# Altium schematic sheet 08.USB3.0-RGMII.SchDoc
size A3; CheckedBy: LJX; DocumentNumber: 8; Revision: V1.00; SheetNumber: 08; SheetTotal: 18; SheetName: USB3.0-RGMII; SheetDescribe: USB3.0-RGMII; Designer: JOW; DesignDate: 2025-05-20; CheckedData: 2025-05-21; Rule: PcbType=ProtelPcb
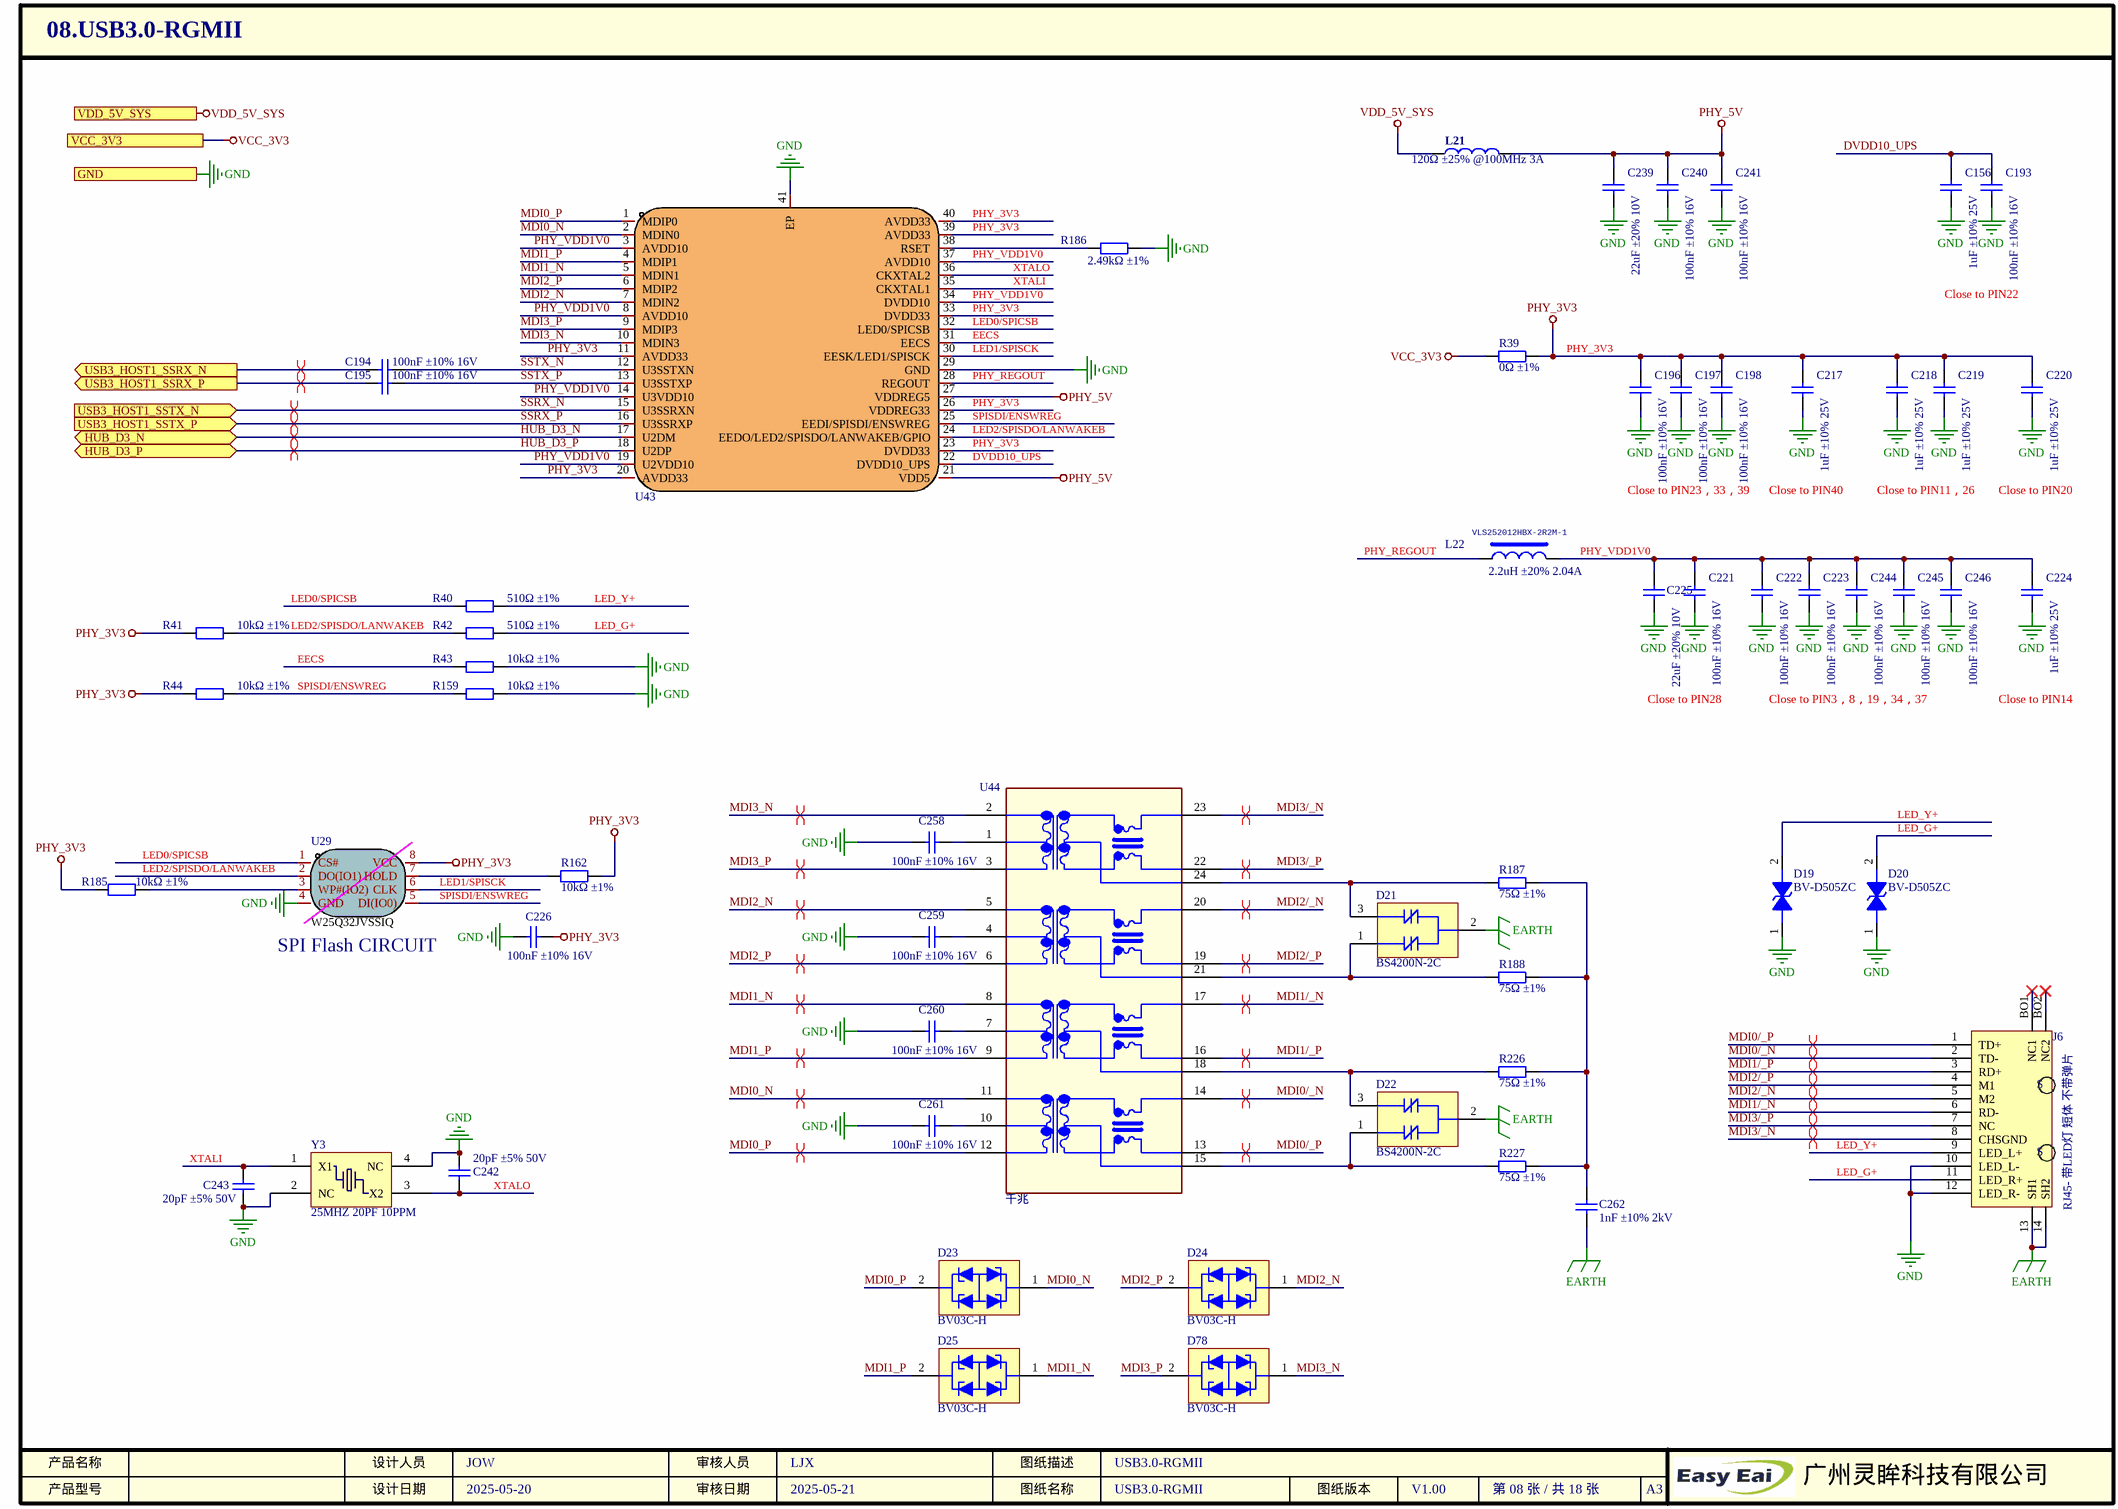
[diagram p0: 08.USB3.0-RGMII.SchDoc]

## Parts
C156  描述: 1uF ±10% 25V  [0402_C]  (hidden comment: CL05A105KA5NQNC)
C193  描述: 100nF ±10% 16V  [0402_C]  (hidden comment: CL05B104KO5NNNC)
C194  描述: 100nF ±10% 16V  [0402_C]  (hidden comment: CL05B104KO5NNNC)
C195  描述: 100nF ±10% 16V  [0402_C]  (hidden comment: CL05B104KO5NNNC)
C196  描述: 100nF ±10% 16V  [0402_C]  (hidden comment: CL05B104KO5NNNC)
C197  描述: 100nF ±10% 16V  [0402_C]  (hidden comment: CL05B104KO5NNNC)
C198  描述: 100nF ±10% 16V  [0402_C]  (hidden comment: CL05B104KO5NNNC)
C217  描述: 1uF ±10% 25V  [0402_C]  (hidden comment: CL05A105KA5NQNC)
C218  描述: 1uF ±10% 25V  [0402_C]  (hidden comment: CL05A105KA5NQNC)
C219  描述: 1uF ±10% 25V  [0402_C]  (hidden comment: CL05A105KA5NQNC)
C220  描述: 1uF ±10% 25V  [0402_C]  (hidden comment: CL05A105KA5NQNC)
C221  描述: 100nF ±10% 16V  [0402_C]  (hidden comment: CL05B104KO5NNNC)
C222  描述: 100nF ±10% 16V  [0402_C]  (hidden comment: CL05B104KO5NNNC)
C223  描述: 100nF ±10% 16V  [0402_C]  (hidden comment: CL05B104KO5NNNC)
C224  描述: 1uF ±10% 25V  [0402_C]  (hidden comment: CL05A105KA5NQNC)
C225  描述: 22uF ±20% 10V  [0603_C]  (hidden comment: CL10A226MP8NUNE)
C226  描述: 100nF ±10% 16V  [0402_C]  (hidden comment: CL05B104KO5NNNC)
C239  描述: 22uF ±20% 10V  [0603_C]  (hidden comment: CL10A226MP8NUNE)
C240  描述: 100nF ±10% 16V  [0402_C]  (hidden comment: CL05B104KO5NNNC)
C241  描述: 100nF ±10% 16V  [0402_C]  (hidden comment: CL05B104KO5NNNC)
C242  描述: 20pF ±5% 50V  [0402_C]  (hidden comment: 0402CG200J500NT)
C243  描述: 20pF ±5% 50V  [0402_C]  (hidden comment: 0402CG200J500NT)
C244  描述: 100nF ±10% 16V  [0402_C]  (hidden comment: CL05B104KO5NNNC)
C245  描述: 100nF ±10% 16V  [0402_C]  (hidden comment: CL05B104KO5NNNC)
C246  描述: 100nF ±10% 16V  [0402_C]  (hidden comment: CL05B104KO5NNNC)
C258  描述: 100nF ±10% 16V  [0402_C]  (hidden comment: CL05B104KO5NNNC)
C259  描述: 100nF ±10% 16V  [0402_C]  (hidden comment: CL05B104KO5NNNC)
C260  描述: 100nF ±10% 16V  [0402_C]  (hidden comment: CL05B104KO5NNNC)
C261  描述: 100nF ±10% 16V  [0402_C]  (hidden comment: CL05B104KO5NNNC)
C262  描述: 1nF ±10% 2kV  [1206_C]  (hidden comment: CC1206KKX7RDBB102)
D19  BV-D505ZC  [SOD-523]
D20  BV-D505ZC  [SOD-523]
D21  BS4200N-2C  [SMB-T_L5.4-W3.3-BI]
D22  BS4200N-2C  [SMB-T_L5.4-W3.3-BI]
D23  BV03C-H  [SOD-323]
D24  BV03C-H  [SOD-323]
D25  BV03C-H  [SOD-323]
D78  BV03C-H  [SOD-323]
J6  R-RJ45R08P-C000  [RJ45/LED-1575X1626X1310]  (value not drawn)
L21  BLM18KG121TN1D  [0603_R]  (value not drawn)
L22  VLS252012HBX-2R2M-1  [IND_252012]
R39  描述: 0Ω ±1%  [0805_R]  (hidden comment: 0805W8F0000T5E)  (no BOM)
R40  描述: 510Ω ±1%  [0402_R]  (hidden comment: 0402WGF5100TCE)
R41  描述: 10kΩ ±1%  [0402_R]  (hidden comment: 0402WGF1002TCE)
R42  描述: 510Ω ±1%  [0402_R]  (hidden comment: 0402WGF5100TCE)
R43  描述: 10kΩ ±1%  [0402_R]  (hidden comment: 0402WGF1002TCE)
R44  描述: 10kΩ ±1%  [0402_R]  (hidden comment: 0402WGF1002TCE)
R159  描述: 10kΩ ±1%  [0402_R]  (hidden comment: 0402WGF1002TCE)  (no BOM)
R162  描述: 10kΩ ±1%  [0402_R]  (hidden comment: 0402WGF1002TCE)
R185  描述: 10kΩ ±1%  [0402_R]  (hidden comment: 0402WGF1002TCE)
R186  描述: 2.49kΩ ±1%  [0402_R]  (hidden comment: AC0402FR-072K49L)
R187  描述: 75Ω ±1%  [0805_R]  (hidden comment: RS-05K75R0FT)
R188  描述: 75Ω ±1%  [0805_R]  (hidden comment: RS-05K75R0FT)
R226  描述: 75Ω ±1%  [0805_R]  (hidden comment: RS-05K75R0FT)
R227  描述: 75Ω ±1%  [0805_R]  (hidden comment: RS-05K75R0FT)
U29  W25Q32JVSSIQ  [SOIC-8-208mil]  (no BOM)
U43  RTL8153B-VB-CG  [QFN-40_L5.0-W5.0-P0.40-BL-EP3.7]  (value not drawn)
U44  描述: 千兆  [SMD-24_L15.1-W7.1-P1.00-LS10.0-BL]  (hidden comment: G2401CE)
Y3  X322525MSB4SI  [SMD-3225_4P]  (value not drawn)

## Ports
GND, HUB_D3_N (bidir), HUB_D3_P (bidir), USB3_HOST1_SSRX_N (out), USB3_HOST1_SSRX_P (out), USB3_HOST1_SSTX_N (in), USB3_HOST1_SSTX_P (in), VCC_3V3, VDD_5V_SYS

## Nets
EARTH: C262.1 D21.2 D22.2 J6.13(SH1) J6.14(SH2)
GND: C156.1 C193.1 C196.1 C197.1 C198.1 C217.1 C218.1 C219.1 C220.1 C221.1 C222.1 C223.1 C224.1 C225.1 C226.2 C239.1 C240.1 C241.1 C242.2 C243.1 C244.1 C245.1 C246.1 C258.1 C259.1 C260.1 C261.1 D19.1 D20.1 J6.10(LED_L-) J6.12(LED_R-) R43.1 R159.1 R186.2 U29.4(GND) U43.29(GND) U43.41(EP) Y3.2(NC) Y3.4(NC) ; port GND
PHY_3V3: C196.2 C197.2 C198.2 C217.2 C218.2 C219.2 C220.2 C226.1 R39.2 R41.2 R44.2 R162.2 R185.2 U29.8(VCC) U43.11(AVDD33) U43.20(AVDD33) U43.23(DVDD33) U43.26(VDDREG33) U43.33(DVDD33) U43.39(AVDD33) U43.40(AVDD33)
PHY_5V: C239.2 C240.2 C241.2 L21.2 U43.21(VDD5) U43.27(VDDREG5)
VCC_3V3: R39.1 ; port VCC_3V3
VDD_5V_SYS: L21.1 ; port VDD_5V_SYS
DVDD10_UPS: C156.2 C193.2 U43.22(DVDD10_UPS)
EECS: R43.2 U43.31(EECS)
HUB_D3_N: U43.17(U2DM) ; port HUB_D3_N
HUB_D3_P: U43.18(U2DP) ; port HUB_D3_P
LED0/SPICSB: R40.1 U29.1(CS#) U43.32(LED0/SPICSB)
LED1/SPISCK: U29.6(CLK) U43.30(EESK/LED1/SPISCK)
LED2/SPISDO/LANWAKEB: R41.1 R42.1 U29.2(DO(IO1)) U43.24(EEDO/LED2/SPISDO/LANWAKEB/GPIO)
LED_G+: D20.2 J6.11(LED_R+) R42.2
LED_Y+: D19.2 J6.9(LED_L+) R40.2
MDI0/_N: J6.2(TD-) U44.14
MDI0/_P: J6.1(TD+) U44.13
MDI0_N: D23.1 U43.2(MDIN0) U44.11
MDI0_P: D23.2 U43.1(MDIP0) U44.12
MDI1/_N: J6.6(RD-) U44.17
MDI1/_P: J6.3(RD+) U44.16
MDI1_N: D25.1 U43.5(MDIN1) U44.8
MDI1_P: D25.2 U43.4(MDIP1) U44.9
MDI2/_N: J6.5(M2) U44.20
MDI2/_P: J6.4(M1) U44.19
MDI2_N: D24.1 U43.7(MDIN2) U44.5
MDI2_P: D24.2 U43.6(MDIP2) U44.6
MDI3/_N: J6.8(CHSGND) U44.23
MDI3/_P: J6.7(NC) U44.22
MDI3_N: D78.1 U43.10(MDIN3) U44.2
MDI3_P: D78.2 U43.9(MDIP3) U44.3
PHY_REGOUT: L22.1 U43.28(REGOUT)
PHY_VDD1V0: C221.2 C222.2 C223.2 C224.2 C225.2 C244.2 C245.2 C246.2 L22.2 U43.3(AVDD10) U43.8(AVDD10) U43.14(U3VDD10) U43.19(U2VDD10) U43.34(DVDD10) U43.37(AVDD10)
SPISDI/ENSWREG: R44.1 R159.2 U29.5(DI(IO0)) U43.25(EEDI/SPISDI/ENSWREG)
SSRX_N: U43.15(U3SSRXN) ; port USB3_HOST1_SSTX_N
SSRX_P: U43.16(U3SSRXP) ; port USB3_HOST1_SSTX_P
SSTX_N: C194.2 U43.12(U3SSTXN)
SSTX_P: C195.2 U43.13(U3SSTXP)
USB3_HOST1_SSRX_N: C194.1 ; port USB3_HOST1_SSRX_N
USB3_HOST1_SSRX_P: C195.1 ; port USB3_HOST1_SSRX_P
XTALI: C243.2 U43.35(CKXTAL1) Y3.1(X1)
XTALO: C242.1 U43.36(CKXTAL2) Y3.3(X2)
NetC258_2: C258.2 U44.1
NetC259_2: C259.2 U44.4
NetC260_2: C260.2 U44.7
NetC261_2: C261.2 U44.10
NetC262_2: C262.2 R187.2 R188.2 R226.2 R227.2
NetD21_1: D21.1 R188.1 U44.21
NetD21_3: D21.3 R187.1 U44.24
NetD22_1: D22.1 R227.1 U44.15
NetD22_3: D22.3 R226.1 U44.18
NetR162_1: R162.1 U29.7(HOLD)
NetR185_1: R185.1 U29.3(WP#(IO2))
NetR186_1: R186.1 U43.38(RSET)

Not connected (* = marked no-connect by the designer): J6 BO1(NC1)* BO2(NC2)*

## Layout directives
differential pair: HUB_D3_N, HUB_D3_P, MDI0/_N, MDI0/_P, MDI0_N, MDI0_P, MDI1/_N, MDI1/_P, MDI1_N, MDI1_P, MDI2/_N, MDI2/_P, MDI2_N, MDI2_P, MDI3/_N, MDI3/_P, MDI3_N, MDI3_P, SSRX_N, SSRX_P, USB3_HOST1_SSRX_N, USB3_HOST1_SSRX_P

## Notes on the sheet
- Close to PIN22
- Close to PIN23，33，39
- Close to PIN40
- Close to PIN11，26
- Close to PIN20
- Close to PIN28
- Close to PIN3，8，19，34，37
- Close to PIN14
- (near U29) SPI Flash CIRCUIT
- 产品名称
- 产品型号
- 设计人员
- 设计日期
- 审核人员
- 审核日期
- 图纸名称
- 图纸描述
- 图纸版本
- A3
- 广州灵眸科技有限公司
- (in symbol RJ45- 带LED灯 短体 不带弹片) S

## Library data of the parts
C156 C217-C220 C224 = 0402 1uF ±10% 25V: SPZL000337; 名称: 贴片电容; 厂商: SAMSUNG(三星); 封装: 0402; 工作温度: -55~85℃; 贴片和直插: SMD; 型号: CL05A105KA5NQNC; SuppliersPartNumber: C52923; 商品编号: SPZL000337
C193-C198 C221-C223 C226 C240 C241 C244-C246 C258-C261 = 0402 100nF ±10% 16V: SPZL000259; 名称: 贴片电容; 厂商: SAMSUNG(三星); 封装: 0402; 工作温度: -55~125℃; 贴片和直插: SMD; 型号: CL05B104KO5NNNC; SuppliersPartNumber: C1525; 商品编号: SPZL000259
C225 C239 = 0603 22uF ±20% 10V: SPZL000315; 名称: 贴片电容; 厂商: SAMSUNG(三星); 封装: 0603; 工作温度: -55~85℃; 贴片和直插: SMD; 型号: CL10A226MP8NUNE; SuppliersPartNumber: C86295; 商品编号: SPZL000315
C242 C243 = 0402 20pF ±5% 50V: SPZL000398; 名称: 贴片电容; 厂商: FH(风华); 封装: 0402; 工作温度: -55~125℃; 贴片和直插: SMD; 型号: 0402CG200J500NT; SuppliersPartNumber: C1554; 商品编号: SPZL000398
C262 = 1206 1nF ±10% 2kV: SPZL000332; 名称: 贴片电容; 厂商: YAGEO(国巨); 封装: 1206; 工作温度: -55~125℃; 贴片和直插: SMD; 型号: CC1206KKX7RDBB102; SuppliersPartNumber: C23631; 商品编号: SPZL000332
D19 D20 = ESD BV-D505ZC: SPZL000613; 名称: ESD; 贴片和直插: SMD; 厂商: Bencent(槟城); 描述: Vdrm=5V Cj=15pF; 工作温度: -40~125℃; SuppliersPartNumber: C459520; 封装: SOD-523; 商品编号: SPZL000613; 型号: BV-D505ZC
D21 D22 = 放电管 BS4200N-2C: SPZL000612; 名称: 放电管; 封装: SMB-T; 贴片和直插: SMD; 厂商: Bencent(槟城); 工作温度: -40~125℃; 商品编号: SPZL000612; 型号: BS4200N-2C
D23-D25 D78 = ESD BV03C-H: SPZL000614; 名称: ESD; 贴片和直插: SMD; 厂商: Bencent(槟城); 描述: Vdrm=3.3V Cj=1.5pF; 工作温度: -55~150℃; 封装: SOD-323; SuppliersPartNumber: C883203; 商品编号: SPZL000614; 型号: BV03C-H
J6 = RJ45- 带LED灯 短体 不带弹片: SPZL000140; 名称: RJ45插座; 贴片和直插: THT; 封装: Through Hole; 厂商: Ckmtw(灿科盟); 工作温度: 0~70℃; SuppliersPartNumber: C386757; 型号: R-RJ45R08P-C000; 商品编号: SPZL000140; 描述: RJ45- 带LED灯 短体 不带弹片
L21 = 120Ω ±25% @100MHz 3A: SPZL000842; 名称: 磁珠; 封装: 0603; 厂商: muRata(村田); 贴片和直插: SMD; 工作温度: -40~85℃; SuppliersPartNumber: C85831; 型号: BLM18KG121TN1D; 商品编号: SPZL000842; 描述: 120Ω ±25% @100MHz 3A
L22 = 2.2uH ±20% 2.04A: SPZL000205; 名称: 电感; 厂商: TDK; 封装: 1008; 贴片和直插: SMD; 工作温度: -40~105℃; 型号: VLS252012HBX-2R2M-1; SuppliersPartNumber: C88535; 商品编号: SPZL000205; 描述: 2.2uH ±20% 2.04A
R39 = 0805 0Ω ±1%: SPZL000350; 封装: 0805; 厂商: UNI-ROYAL(厚声); 名称: 电阻; 贴片和直插: SMD; 工作温度: -55~155℃; SuppliersPartNumber: C17477; 型号: 0805W8F0000T5E; 商品编号: SPZL000350
R40 R42 = 0402 510Ω ±1%: SPZL000335; 封装: 0402; 厂商: UNI-ROYAL(厚声); 贴片和直插: SMD; 名称: 电阻; 工作温度: -55~155℃; SuppliersPartNumber: C25123; 型号: 0402WGF5100TCE; 商品编号: SPZL000335
R41 R43 R44 R159 R162 R185 = 0402 10kΩ ±1%: SPZL000271; 封装: 0402; 厂商: UNI-ROYAL(厚声); 贴片和直插: SMD; 名称: 电阻; 工作温度: -55~155℃; SuppliersPartNumber: C25744; 型号: 0402WGF1002TCE; 商品编号: SPZL000271
R186 = 0402 2.49kΩ ±1%: SPZL000354; 封装: 0402; 厂商: YAGEO(国巨); 贴片和直插: SMD; 名称: 电阻; 工作温度: -55~155℃; SuppliersPartNumber: C226959; 型号: AC0402FR-072K49L; 商品编号: SPZL000354
R187 R188 R226 R227 = 0805 75Ω ±1%: SPZL000353; 封装: 0805; 厂商: FH(风华); 名称: 电阻; 贴片和直插: SMD; 工作温度: -55~155℃; SuppliersPartNumber: C139842; 型号: RS-05K75R0FT; 商品编号: SPZL000353
U29 = W25Q32JVSSIQ: SPZL001045; 名称: IC; 描述: NOR FLASH; 厂商: WINBOND(华邦); 封装: SOIC-8; 贴片和直插: SMD; 工作温度: -40~85℃; 商品编号: SPZL001045; SuppliersPartNumber: C179173; 型号: W25Q32JVSSIQ
U43 = RTL8153B-VB-CG: SPZL001044; 名称: IC; 描述: USB3.0转千兆芯片; 厂商: REALTEK(瑞昱); 封装: QFN-40-EP(5x5); 工作温度: 0~70℃; 贴片和直插: SMD; SuppliersPartNumber: C2802072; 型号: RTL8153B-VB-CG; 商品编号: SPZL001044
U44 = 网络变压器 G2401CE: SPZL000720; 封装: SMD; 名称: 网络变压器; 厂商: Mentech(铭普光磁); 工作温度: -40~+85℃; 型号: G2401CE; 贴片和直插: SMD; SuppliersPartNumber: C2904710; 商品编号: SPZL000720
Y3 = 25MHZ 20PF 10PPM: SPZL000475; 封装: SMD3225-4P; 厂商: YXC扬兴科技; 贴片和直插: SMD; 名称: 无源晶振; 工作温度: -40~85℃; SuppliersPartNumber: C13740; 型号: X322525MSB4SI; 商品编号: SPZL000475; 描述: 25MHZ 20PF 10PPM